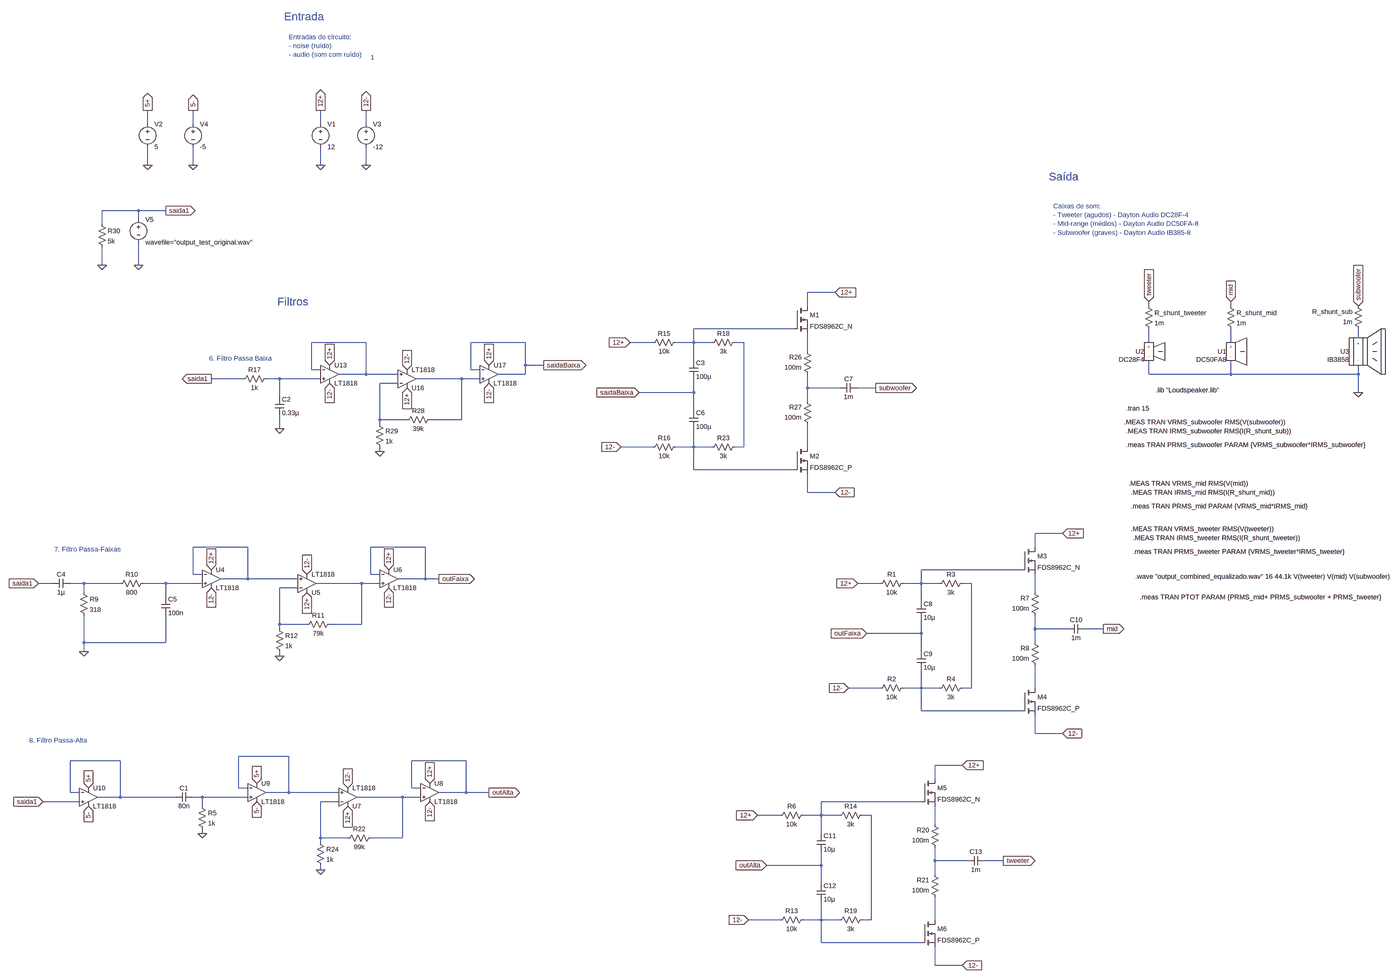
[diagram p0: schematic circuito_filtros.asc, whole sheet]
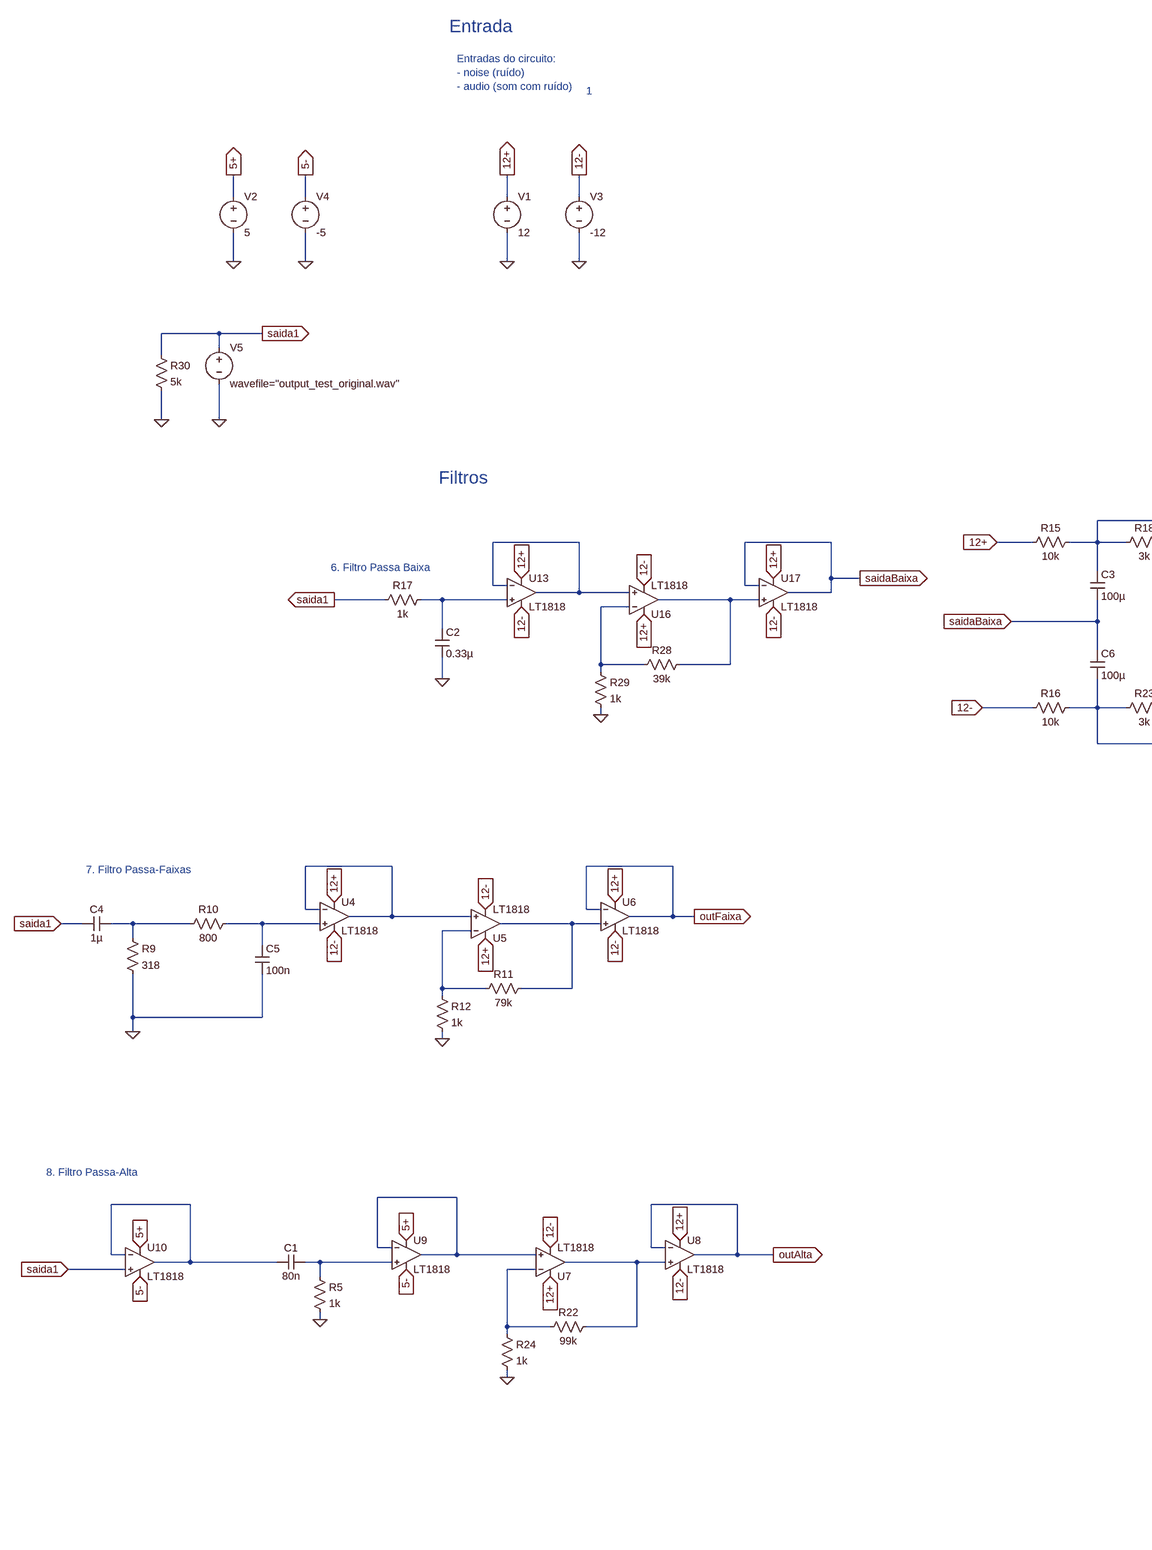
[diagram p1: schematic circuito_filtros.asc, part, row 1 of 1, column 1 of 2]
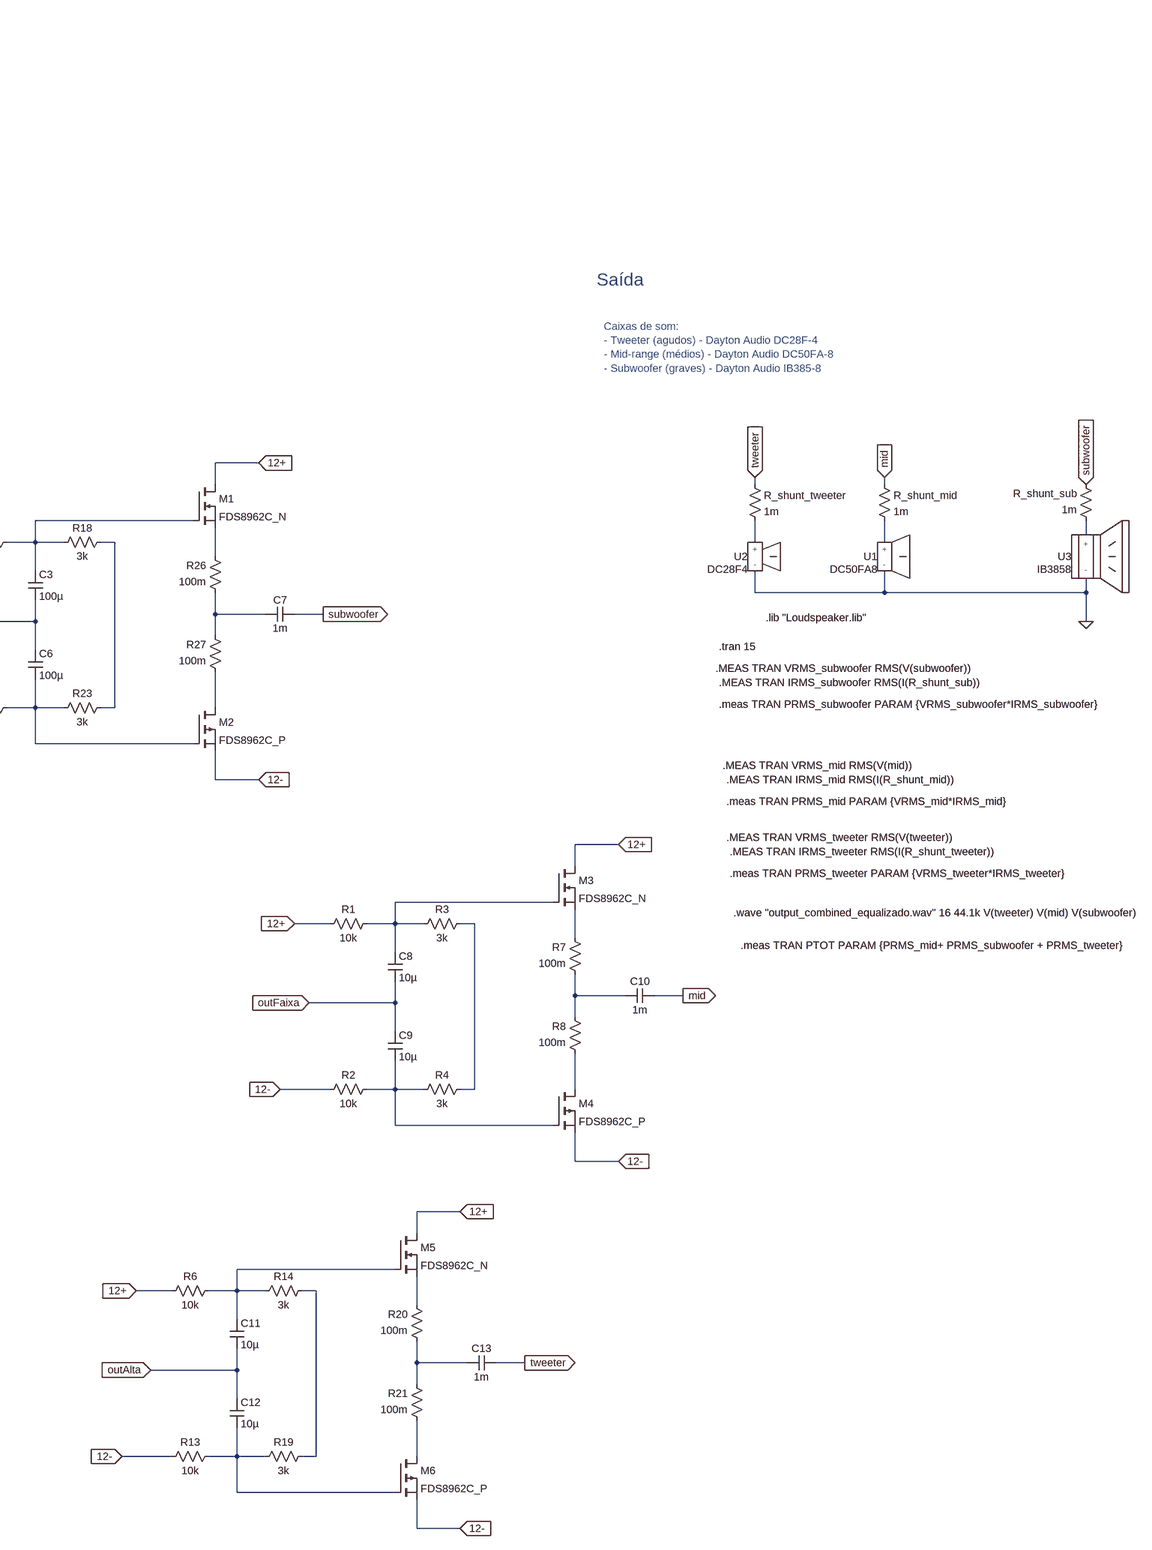
[diagram p2: schematic circuito_filtros.asc, part, row 1 of 1, column 2 of 2]
circuito_filtros.asc, the LTspice schematic file:
Version 4
SHEET 1 3960 3428
WIRE -1296 176 -1296 128
WIRE -1136 176 -1136 128
WIRE -688 176 -688 128
WIRE -528 176 -528 128
WIRE -1296 320 -1296 256
WIRE -1136 320 -1136 256
WIRE -688 320 -688 256
WIRE -528 320 -528 256
WIRE -1328 480 -1456 480
WIRE -1232 480 -1328 480
WIRE -1328 512 -1328 480
WIRE -1456 528 -1456 480
WIRE -1456 672 -1456 608
WIRE -1328 672 -1328 592
WIRE 1120 768 1024 768
WIRE 1024 816 1024 768
WIRE 2224 816 2224 800
WIRE 2512 816 2512 800
WIRE 976 896 624 896
WIRE 2960 928 2960 896
WIRE -528 944 -720 944
WIRE 32 944 -160 944
WIRE 480 944 400 944
WIRE 624 944 624 896
WIRE 624 944 560 944
WIRE 688 944 624 944
WIRE 800 944 768 944
WIRE 2224 944 2224 896
WIRE 2512 944 2512 896
WIRE 1024 976 1024 912
WIRE 624 1008 624 944
WIRE 32 1024 32 944
WIRE 96 1024 32 1024
WIRE -720 1040 -720 944
WIRE -688 1040 -720 1040
WIRE -160 1040 -160 944
WIRE -128 1040 -160 1040
WIRE -528 1056 -528 944
WIRE -528 1056 -624 1056
WIRE -416 1056 -528 1056
WIRE 32 1056 32 1024
WIRE 32 1056 -64 1056
WIRE 2224 1056 2224 1008
WIRE 2512 1056 2512 1008
WIRE 2512 1056 2224 1056
WIRE 2960 1056 2960 1024
WIRE 2960 1056 2512 1056
WIRE -960 1072 -1072 1072
WIRE -832 1072 -880 1072
WIRE -688 1072 -832 1072
WIRE -192 1072 -352 1072
WIRE -128 1072 -192 1072
WIRE -416 1088 -480 1088
WIRE 1024 1104 1024 1056
WIRE 1136 1104 1024 1104
WIRE 1264 1104 1200 1104
WIRE 624 1120 624 1072
WIRE 624 1120 432 1120
WIRE 2960 1120 2960 1056
WIRE -832 1136 -832 1072
WIRE 1024 1152 1024 1104
WIRE 624 1184 624 1120
WIRE -480 1216 -480 1088
WIRE -384 1216 -480 1216
WIRE -192 1216 -192 1072
WIRE -192 1216 -304 1216
WIRE -480 1232 -480 1216
WIRE -832 1248 -832 1200
WIRE 480 1312 368 1312
WIRE 624 1312 624 1248
WIRE 624 1312 560 1312
WIRE 688 1312 624 1312
WIRE 800 1312 800 944
WIRE 800 1312 768 1312
WIRE 1024 1312 1024 1232
WIRE -480 1328 -480 1312
WIRE 624 1392 624 1312
WIRE 976 1392 624 1392
WIRE 1024 1472 1024 1408
WIRE 1120 1472 1024 1472
WIRE 1920 1616 1824 1616
WIRE -944 1664 -1136 1664
WIRE -320 1664 -512 1664
WIRE 1824 1664 1824 1616
WIRE 1776 1744 1424 1744
WIRE -1136 1760 -1136 1664
WIRE -1104 1760 -1136 1760
WIRE -512 1760 -512 1664
WIRE -480 1760 -512 1760
WIRE -944 1776 -944 1664
WIRE -944 1776 -1040 1776
WIRE -768 1776 -944 1776
WIRE -320 1776 -320 1664
WIRE -320 1776 -416 1776
WIRE -272 1776 -320 1776
WIRE -1632 1792 -1680 1792
WIRE -1520 1792 -1568 1792
WIRE -1392 1792 -1520 1792
WIRE -1232 1792 -1312 1792
WIRE -1104 1792 -1232 1792
WIRE -544 1792 -704 1792
WIRE -480 1792 -544 1792
WIRE 1280 1792 1200 1792
WIRE 1424 1792 1424 1744
WIRE 1424 1792 1360 1792
WIRE 1488 1792 1424 1792
WIRE 1600 1792 1568 1792
WIRE -768 1808 -832 1808
WIRE -1520 1824 -1520 1792
WIRE 1824 1824 1824 1760
WIRE -1232 1840 -1232 1792
WIRE 1424 1856 1424 1792
WIRE -832 1936 -832 1808
WIRE -736 1936 -832 1936
WIRE -544 1936 -544 1792
WIRE -544 1936 -656 1936
WIRE -832 1952 -832 1936
WIRE 1824 1952 1824 1904
WIRE 1936 1952 1824 1952
WIRE 2064 1952 2000 1952
WIRE 1424 1968 1424 1920
WIRE 1424 1968 1232 1968
WIRE -1520 2000 -1520 1904
WIRE -1232 2000 -1232 1904
WIRE -1232 2000 -1520 2000
WIRE 1824 2000 1824 1952
WIRE -1520 2032 -1520 2000
WIRE 1424 2032 1424 1968
WIRE -832 2048 -832 2032
WIRE 1280 2160 1168 2160
WIRE 1424 2160 1424 2096
WIRE 1424 2160 1360 2160
WIRE 1488 2160 1424 2160
WIRE 1600 2160 1600 1792
WIRE 1600 2160 1568 2160
WIRE 1824 2160 1824 2080
WIRE 1424 2240 1424 2160
WIRE 1776 2240 1424 2240
WIRE 1824 2320 1824 2256
WIRE 1920 2320 1824 2320
WIRE -800 2400 -976 2400
WIRE -1392 2416 -1568 2416
WIRE -176 2416 -368 2416
WIRE 1568 2432 1472 2432
WIRE 1472 2480 1472 2432
WIRE -976 2512 -976 2400
WIRE -944 2512 -976 2512
WIRE -368 2512 -368 2416
WIRE -336 2512 -368 2512
WIRE -1568 2528 -1568 2416
WIRE -1536 2528 -1568 2528
WIRE -800 2528 -800 2400
WIRE -800 2528 -880 2528
WIRE -624 2528 -800 2528
WIRE -176 2528 -176 2416
WIRE -176 2528 -272 2528
WIRE -96 2528 -176 2528
WIRE -1392 2544 -1392 2416
WIRE -1392 2544 -1472 2544
WIRE -1200 2544 -1392 2544
WIRE -1104 2544 -1136 2544
WIRE -944 2544 -1104 2544
WIRE -400 2544 -560 2544
WIRE -336 2544 -400 2544
WIRE -1536 2560 -1664 2560
WIRE -624 2560 -688 2560
WIRE 1424 2560 1072 2560
WIRE -1104 2576 -1104 2544
WIRE 928 2608 848 2608
WIRE 1072 2608 1072 2560
WIRE 1072 2608 1008 2608
WIRE 1136 2608 1072 2608
WIRE 1248 2608 1216 2608
WIRE 1472 2640 1472 2576
WIRE -1104 2672 -1104 2656
WIRE 1072 2672 1072 2608
WIRE -688 2688 -688 2560
WIRE -592 2688 -688 2688
WIRE -400 2688 -400 2544
WIRE -400 2688 -512 2688
WIRE -688 2704 -688 2688
WIRE 1472 2768 1472 2720
WIRE 1584 2768 1472 2768
WIRE 1712 2768 1648 2768
WIRE 1072 2784 1072 2736
WIRE 1072 2784 880 2784
WIRE -688 2800 -688 2784
WIRE 1472 2816 1472 2768
WIRE 1072 2848 1072 2784
WIRE 928 2976 816 2976
WIRE 1072 2976 1072 2912
WIRE 1072 2976 1008 2976
WIRE 1136 2976 1072 2976
WIRE 1248 2976 1248 2608
WIRE 1248 2976 1216 2976
WIRE 1472 2976 1472 2896
WIRE 1072 3056 1072 2976
WIRE 1424 3056 1072 3056
WIRE 1472 3136 1472 3072
WIRE 1568 3136 1472 3136
FLAG 2960 1120 0
FLAG 2224 800 tweeter
IOPIN 2224 800 In
FLAG 2512 800 mid
IOPIN 2512 800 In
FLAG 2960 816 subwoofer
IOPIN 2960 816 In
FLAG -1296 320 0
FLAG -1296 128 5+
IOPIN -1296 128 Out
FLAG -1136 320 0
FLAG -1136 128 5-
IOPIN -1136 128 Out
FLAG -1664 2560 saida1
IOPIN -1664 2560 In
FLAG -1104 2672 0
FLAG -912 2496 5+
IOPIN -912 2496 In
FLAG -912 2560 5-
IOPIN -912 2560 In
FLAG -1504 2512 5+
IOPIN -1504 2512 In
FLAG -1504 2576 5-
IOPIN -1504 2576 In
FLAG -1680 1792 saida1
IOPIN -1680 1792 In
FLAG -1072 1072 saida1
IOPIN -1072 1072 Out
FLAG -656 1024 12+
IOPIN -656 1024 In
FLAG -656 1088 12-
IOPIN -656 1088 In
FLAG 96 1024 saidaBaixa
IOPIN 96 1024 Out
FLAG -832 1248 0
FLAG 400 944 12+
IOPIN 400 944 In
FLAG 368 1312 12-
IOPIN 368 1312 In
FLAG 1264 1104 subwoofer
IOPIN 1264 1104 Out
FLAG 1120 768 12+
IOPIN 1120 768 In
FLAG 1120 1472 12-
IOPIN 1120 1472 In
FLAG 432 1120 saidaBaixa
IOPIN 432 1120 In
FLAG -384 1104 12+
IOPIN -384 1104 In
FLAG -384 1040 12-
IOPIN -384 1040 In
FLAG -480 1328 0
FLAG -96 1024 12+
IOPIN -96 1024 In
FLAG -96 1088 12-
IOPIN -96 1088 In
FLAG -1328 672 0
FLAG -1456 672 0
FLAG -1232 480 saida1
IOPIN -1232 480 Out
FLAG -688 320 0
FLAG -688 128 12+
IOPIN -688 128 Out
FLAG -528 320 0
FLAG -528 128 12-
IOPIN -528 128 Out
FLAG -272 1776 outFaixa
IOPIN -272 1776 Out
FLAG 1200 1792 12+
IOPIN 1200 1792 In
FLAG 1168 2160 12-
IOPIN 1168 2160 In
FLAG 2064 1952 mid
IOPIN 2064 1952 Out
FLAG 1920 1616 12+
IOPIN 1920 1616 In
FLAG 1920 2320 12-
IOPIN 1920 2320 In
FLAG 1232 1968 outFaixa
IOPIN 1232 1968 In
FLAG -1520 2032 0
FLAG -1072 1744 12+
IOPIN -1072 1744 In
FLAG -1072 1808 12-
IOPIN -1072 1808 In
FLAG -736 1824 12+
IOPIN -736 1824 In
FLAG -736 1760 12-
IOPIN -736 1760 In
FLAG -832 2048 0
FLAG -448 1744 12+
IOPIN -448 1744 In
FLAG -448 1808 12-
IOPIN -448 1808 In
FLAG -96 2528 outAlta
IOPIN -96 2528 Out
FLAG 848 2608 12+
IOPIN 848 2608 In
FLAG 816 2976 12-
IOPIN 816 2976 In
FLAG 1712 2768 tweeter
IOPIN 1712 2768 Out
FLAG 1568 2432 12+
IOPIN 1568 2432 In
FLAG 1568 3136 12-
IOPIN 1568 3136 In
FLAG 880 2784 outAlta
IOPIN 880 2784 In
FLAG -592 2576 12+
IOPIN -592 2576 In
FLAG -592 2512 12-
IOPIN -592 2512 In
FLAG -688 2800 0
FLAG -304 2496 12+
IOPIN -304 2496 In
FLAG -304 2560 12-
IOPIN -304 2560 In
SYMBOL MidRange 2512 976 R0
WINDOW 38 -16 28 Right 2
SYMATTR SpiceModel DC50FA8
SYMATTR InstName U1
SYMBOL Tweeter 2224 976 R0
WINDOW 38 -16 28 Right 2
SYMATTR SpiceModel DC28F4
SYMATTR InstName U2
SYMBOL Woofer 2960 976 R0
WINDOW 38 -32 28 Right 2
SYMATTR SpiceModel IB3858
SYMATTR InstName U3
SYMBOL voltage -1296 160 R0
SYMATTR InstName V2
SYMATTR Value 5
SYMBOL voltage -1136 160 R0
WINDOW 123 0 0 Left 0
WINDOW 39 0 0 Left 0
SYMATTR InstName V4
SYMATTR Value -5
SYMBOL res -1120 2560 R0
SYMATTR InstName R5
SYMATTR Value 1k
SYMBOL cap -1136 2528 R90
WINDOW 0 0 32 VBottom 2
WINDOW 3 32 32 VTop 2
SYMATTR InstName C1
SYMATTR Value 80n
SYMBOL OpAmps\\LT1818 -912 2528 R0
SYMATTR InstName U9
SYMBOL OpAmps\\LT1818 -1504 2544 R0
SYMATTR InstName U10
SYMBOL res -864 1056 R90
WINDOW 0 0 56 VBottom 2
WINDOW 3 32 56 VTop 2
SYMATTR InstName R17
SYMATTR Value 1k
SYMBOL cap -848 1136 R0
SYMATTR InstName C2
SYMATTR Value 0.33µ
SYMBOL OpAmps\\LT1818 -656 1056 R0
SYMATTR InstName U13
SYMBOL res 576 928 R90
WINDOW 0 0 56 VBottom 2
WINDOW 3 32 56 VTop 2
SYMATTR InstName R15
SYMATTR Value 10k
SYMBOL res 576 1296 R90
WINDOW 0 0 56 VBottom 2
WINDOW 3 32 56 VTop 2
SYMATTR InstName R16
SYMATTR Value 10k
SYMBOL res 784 928 R90
WINDOW 0 0 56 VBottom 2
WINDOW 3 32 56 VTop 2
SYMATTR InstName R18
SYMATTR Value 3k
SYMBOL res 784 1296 R90
WINDOW 0 0 56 VBottom 2
WINDOW 3 32 56 VTop 2
SYMATTR InstName R23
SYMATTR Value 3k
SYMBOL res 1040 1072 R180
WINDOW 0 36 76 Left 2
WINDOW 3 36 40 Left 2
SYMATTR InstName R26
SYMATTR Value 100m
SYMBOL res 1040 1248 R180
WINDOW 0 36 76 Left 2
WINDOW 3 36 40 Left 2
SYMATTR InstName R27
SYMATTR Value 100m
SYMBOL nmos 976 816 R0
SYMATTR InstName M1
SYMATTR Value FDS8962C_N
SYMBOL pmos 976 1312 R0
SYMATTR InstName M2
SYMATTR Value FDS8962C_P
SYMBOL cap 608 1008 R0
SYMATTR InstName C3
SYMATTR Value 100µ
SYMBOL cap 608 1184 R0
SYMATTR InstName C6
SYMATTR Value 100µ
SYMBOL cap 1200 1088 R90
WINDOW 0 0 32 VBottom 2
WINDOW 3 32 32 VTop 2
SYMATTR InstName C7
SYMATTR Value 1m
SYMBOL OpAmps\\LT1818 -384 1072 M180
SYMATTR InstName U16
SYMBOL res -288 1200 R90
WINDOW 0 0 56 VBottom 2
WINDOW 3 32 56 VTop 2
SYMATTR InstName R28
SYMATTR Value 39k
SYMBOL res -496 1216 R0
SYMATTR InstName R29
SYMATTR Value 1k
SYMBOL OpAmps\\LT1818 -96 1056 R0
SYMATTR InstName U17
SYMBOL voltage -1328 496 R0
SYMATTR InstName V5
SYMATTR Value wavefile="output_test_original.wav"
SYMBOL res -1472 512 R0
SYMATTR InstName R30
SYMATTR Value 5k
SYMBOL voltage -688 160 R0
SYMATTR InstName V1
SYMATTR Value 12
SYMBOL voltage -528 160 R0
WINDOW 123 0 0 Left 0
WINDOW 39 0 0 Left 0
SYMATTR InstName V3
SYMATTR Value -12
SYMBOL res 2976 912 R180
WINDOW 0 36 76 Left 2
WINDOW 3 36 40 Left 2
SYMATTR InstName R_shunt_sub
SYMATTR Value 1m
SYMBOL res 2496 800 R0
SYMATTR InstName R_shunt_mid
SYMATTR Value 1m
SYMBOL res 1376 1776 R90
WINDOW 0 0 56 VBottom 2
WINDOW 3 32 56 VTop 2
SYMATTR InstName R1
SYMATTR Value 10k
SYMBOL res 1376 2144 R90
WINDOW 0 0 56 VBottom 2
WINDOW 3 32 56 VTop 2
SYMATTR InstName R2
SYMATTR Value 10k
SYMBOL res 1584 1776 R90
WINDOW 0 0 56 VBottom 2
WINDOW 3 32 56 VTop 2
SYMATTR InstName R3
SYMATTR Value 3k
SYMBOL res 1584 2144 R90
WINDOW 0 0 56 VBottom 2
WINDOW 3 32 56 VTop 2
SYMATTR InstName R4
SYMATTR Value 3k
SYMBOL res 1840 1920 R180
WINDOW 0 36 76 Left 2
WINDOW 3 36 40 Left 2
SYMATTR InstName R7
SYMATTR Value 100m
SYMBOL res 1840 2096 R180
WINDOW 0 36 76 Left 2
WINDOW 3 36 40 Left 2
SYMATTR InstName R8
SYMATTR Value 100m
SYMBOL nmos 1776 1664 R0
SYMATTR InstName M3
SYMATTR Value FDS8962C_N
SYMBOL pmos 1776 2160 R0
SYMATTR InstName M4
SYMATTR Value FDS8962C_P
SYMBOL cap 1408 1856 R0
SYMATTR InstName C8
SYMATTR Value 10µ
SYMBOL cap 1408 2032 R0
SYMATTR InstName C9
SYMATTR Value 10µ
SYMBOL cap 2000 1936 R90
WINDOW 0 0 32 VBottom 2
WINDOW 3 32 32 VTop 2
SYMATTR InstName C10
SYMATTR Value 1m
SYMBOL cap -1568 1776 R90
WINDOW 0 0 32 VBottom 2
WINDOW 3 32 32 VTop 2
SYMATTR InstName C4
SYMATTR Value 1µ
SYMBOL res -1536 1808 R0
SYMATTR InstName R9
SYMATTR Value 318
SYMBOL cap -1248 1840 R0
SYMATTR InstName C5
SYMATTR Value 100n
SYMBOL res -1296 1776 R90
WINDOW 0 0 56 VBottom 2
WINDOW 3 32 56 VTop 2
SYMATTR InstName R10
SYMATTR Value 800
SYMBOL OpAmps\\LT1818 -1072 1776 R0
SYMATTR InstName U4
SYMBOL OpAmps\\LT1818 -736 1792 M180
SYMATTR InstName U5
SYMBOL res -640 1920 R90
WINDOW 0 0 56 VBottom 2
WINDOW 3 32 56 VTop 2
SYMATTR InstName R11
SYMATTR Value 79k
SYMBOL res -848 1936 R0
SYMATTR InstName R12
SYMATTR Value 1k
SYMBOL OpAmps\\LT1818 -448 1776 R0
SYMATTR InstName U6
SYMBOL res 1024 2592 R90
WINDOW 0 0 56 VBottom 2
WINDOW 3 32 56 VTop 2
SYMATTR InstName R6
SYMATTR Value 10k
SYMBOL res 1024 2960 R90
WINDOW 0 0 56 VBottom 2
WINDOW 3 32 56 VTop 2
SYMATTR InstName R13
SYMATTR Value 10k
SYMBOL res 1232 2592 R90
WINDOW 0 0 56 VBottom 2
WINDOW 3 32 56 VTop 2
SYMATTR InstName R14
SYMATTR Value 3k
SYMBOL res 1232 2960 R90
WINDOW 0 0 56 VBottom 2
WINDOW 3 32 56 VTop 2
SYMATTR InstName R19
SYMATTR Value 3k
SYMBOL res 1488 2736 R180
WINDOW 0 36 76 Left 2
WINDOW 3 36 40 Left 2
SYMATTR InstName R20
SYMATTR Value 100m
SYMBOL res 1488 2912 R180
WINDOW 0 36 76 Left 2
WINDOW 3 36 40 Left 2
SYMATTR InstName R21
SYMATTR Value 100m
SYMBOL nmos 1424 2480 R0
SYMATTR InstName M5
SYMATTR Value FDS8962C_N
SYMBOL pmos 1424 2976 R0
SYMATTR InstName M6
SYMATTR Value FDS8962C_P
SYMBOL cap 1056 2672 R0
SYMATTR InstName C11
SYMATTR Value 10µ
SYMBOL cap 1056 2848 R0
SYMATTR InstName C12
SYMATTR Value 10µ
SYMBOL cap 1648 2752 R90
WINDOW 0 0 32 VBottom 2
WINDOW 3 32 32 VTop 2
SYMATTR InstName C13
SYMATTR Value 1m
SYMBOL res 2208 800 R0
SYMATTR InstName R_shunt_tweeter
SYMATTR Value 1m
SYMBOL OpAmps\\LT1818 -592 2544 M180
SYMATTR InstName U7
SYMBOL res -496 2672 R90
WINDOW 0 0 56 VBottom 2
WINDOW 3 32 56 VTop 2
SYMATTR InstName R22
SYMATTR Value 99k
SYMBOL res -704 2688 R0
SYMATTR InstName R24
SYMATTR Value 1k
SYMBOL OpAmps\\LT1818 -304 2528 R0
SYMATTR InstName U8
TEXT -800 -216 Left 2 ;Entradas do circuito:\n- noise (ruído)\n- audio (som com ruído)
TEXT 1888 464 Left 2 ;Caixas de som:\n- Tweeter (agudos) - Dayton Audio DC28F-4\n- Mid-range (médios) - Dayton Audio DC50FA-8\n- Subwoofer (graves) - Dayton Audio IB385-8
TEXT 2248 1112 Left 2 !.lib "Loudspeaker.lib"
TEXT -512 -144 Left 2 ;1
TEXT -1080 1000 Left 2 ;6. Filtro Passa Baixa
TEXT -840 800 Left 4 ;Filtros
TEXT -1624 1672 Left 2 ;7. Filtro Passa-Faixas
TEXT -1712 2344 Left 2 ;8. Filtro Passa-Alta
TEXT 1872 360 Left 4 ;Saída
TEXT -816 -288 Left 4 ;Entrada
TEXT 2144 1176 Left 2 !.tran 15
TEXT 2136 1224 Left 2 !.MEAS TRAN VRMS_subwoofer RMS(V(subwoofer))
TEXT 2144 1256 Left 2 !.MEAS TRAN IRMS_subwoofer RMS(I(R_shunt_sub))
TEXT 2144 1304 Left 2 !.meas TRAN PRMS_subwoofer PARAM {VRMS_subwoofer*IRMS_subwoofer}
TEXT 2152 1440 Left 2 !.MEAS TRAN VRMS_mid RMS(V(mid))
TEXT 2160 1472 Left 2 !.MEAS TRAN IRMS_mid RMS(I(R_shunt_mid))
TEXT 2160 1520 Left 2 !.meas TRAN PRMS_mid PARAM {VRMS_mid*IRMS_mid}
TEXT 2160 1600 Left 2 !.MEAS TRAN VRMS_tweeter RMS(V(tweeter))
TEXT 2168 1632 Left 2 !.MEAS TRAN IRMS_tweeter RMS(I(R_shunt_tweeter))
TEXT 2168 1680 Left 2 !.meas TRAN PRMS_tweeter PARAM {VRMS_tweeter*IRMS_tweeter}
TEXT 2176 1768 Left 2 !.wave "output_combined_equalizado.wav" 16 44.1k V(tweeter) V(mid) V(subwoofer)
TEXT 2192 1840 Left 2 !.meas TRAN PTOT PARAM {PRMS_mid+ PRMS_subwoofer + PRMS_tweeter}

The netlist it stands for:
* circuito_filtros.asc
XU1 N006 0 DC50FA8  ; pins + -
XU2 N005 0 DC28F4  ; pins + -
XU3 N002 0 IB3858  ; pins + -
V2 5+ 0 5
V4 5- 0 -5
R5 N027 0 1k
C1 N027 N026 80n
XU9 N027 N025 N025 5+ 5- LT1818  ; pins In+ In- OUT V+ V-
XU10 saida1 N026 N026 5+ 5- LT1818  ; pins In+ In- OUT V+ V-
R17 N008 saida1 1k
C2 N008 0 0.33µ
XU13 N008 N003 N003 12+ 12- LT1818  ; pins In+ In- OUT V+ V-
R15 N001 12+ 10k
R16 N012 12- 10k
R18 N004 N001 3k
R23 N004 N012 3k
R26 N011 N007 100m
R27 N013 N011 100m
M1 12+ N001 N007 N007 FDS8962C_N
M2 N013 N012 12- 12- FDS8962C_P
C3 N001 saidaBaixa 100µ
C6 saidaBaixa N012 100µ
C7 subwoofer N011 1m
XU16 N003 N010 N009 12+ 12- LT1818  ; pins In+ In- OUT V+ V-
R28 N009 N010 39k
R29 N010 0 1k
XU17 N009 saidaBaixa saidaBaixa 12+ 12- LT1818  ; pins In+ In- OUT V+ V-
V5 saida1 0 wavefile="output_test_original.wav"
R30 saida1 0 5k
V1 12+ 0 12
V3 12- 0 -12
R_shunt_sub N002 subwoofer 1m
R_shunt_mid mid N006 1m
R1 N015 12+ 10k
R2 N023 12- 10k
R3 N019 N015 3k
R4 N019 N023 3k
R7 N022 N021 100m
R8 N024 N022 100m
M3 12+ N015 N021 N021 FDS8962C_N
M4 N024 N023 12- 12- FDS8962C_P
C8 N015 outFaixa 10µ
C9 outFaixa N023 10µ
C10 mid N022 1m
C4 N016 saida1 1µ
R9 N016 0 318
C5 N017 0 100n
R10 N017 N016 800
XU4 N017 N014 N014 12+ 12- LT1818  ; pins In+ In- OUT V+ V-
XU5 N014 N020 N018 12+ 12- LT1818  ; pins In+ In- OUT V+ V-
R11 N018 N020 79k
R12 N020 0 1k
XU6 N018 outFaixa outFaixa 12+ 12- LT1818  ; pins In+ In- OUT V+ V-
R6 N030 12+ 10k
R13 N034 12- 10k
R14 N031 N030 3k
R19 N031 N034 3k
R20 N033 N032 100m
R21 N035 N033 100m
M5 12+ N030 N032 N032 FDS8962C_N
M6 N035 N034 12- 12- FDS8962C_P
C11 N030 outAlta 10µ
C12 outAlta N034 10µ
C13 tweeter N033 1m
R_shunt_tweeter tweeter N005 1m
XU7 N025 N029 N028 12+ 12- LT1818  ; pins In+ In- OUT V+ V-
R22 N028 N029 99k
R24 N029 0 1k
XU8 N028 outAlta outAlta 12+ 12- LT1818  ; pins In+ In- OUT V+ V-
.model NMOS NMOS
.model PMOS PMOS
.lib standard.mos
* Entradas do circuito:
* - noise (ruído)
* - audio (som com ruído)
* Caixas de som:
* - Tweeter (agudos) - Dayton Audio DC28F-4
* - Mid-range (médios) - Dayton Audio DC50FA-8
* - Subwoofer (graves) - Dayton Audio IB385-8
.lib "Loudspeaker.lib"
* 1
* 6. Filtro Passa Baixa
* Filtros
* 7. Filtro Passa-Faixas
* 8. Filtro Passa-Alta
* Saída
* Entrada
.tran 15
.MEAS TRAN VRMS_subwoofer RMS(V(subwoofer))
.MEAS TRAN IRMS_subwoofer RMS(I(R_shunt_sub))
.meas TRAN PRMS_subwoofer PARAM {VRMS_subwoofer*IRMS_subwoofer}
.MEAS TRAN VRMS_mid RMS(V(mid))
.MEAS TRAN IRMS_mid RMS(I(R_shunt_mid))
.meas TRAN PRMS_mid PARAM {VRMS_mid*IRMS_mid}
.MEAS TRAN VRMS_tweeter RMS(V(tweeter))
.MEAS TRAN IRMS_tweeter RMS(I(R_shunt_tweeter))
.meas TRAN PRMS_tweeter PARAM {VRMS_tweeter*IRMS_tweeter}
.wave "output_combined_equalizado.wav" 16 44.1k V(tweeter) V(mid) V(subwoofer)
.meas TRAN PTOT PARAM {PRMS_mid+ PRMS_subwoofer + PRMS_tweeter}
.lib LTC2.lib
.backanno
.end